# EAGLE design sensor_array (EAGLE 7.2.1)
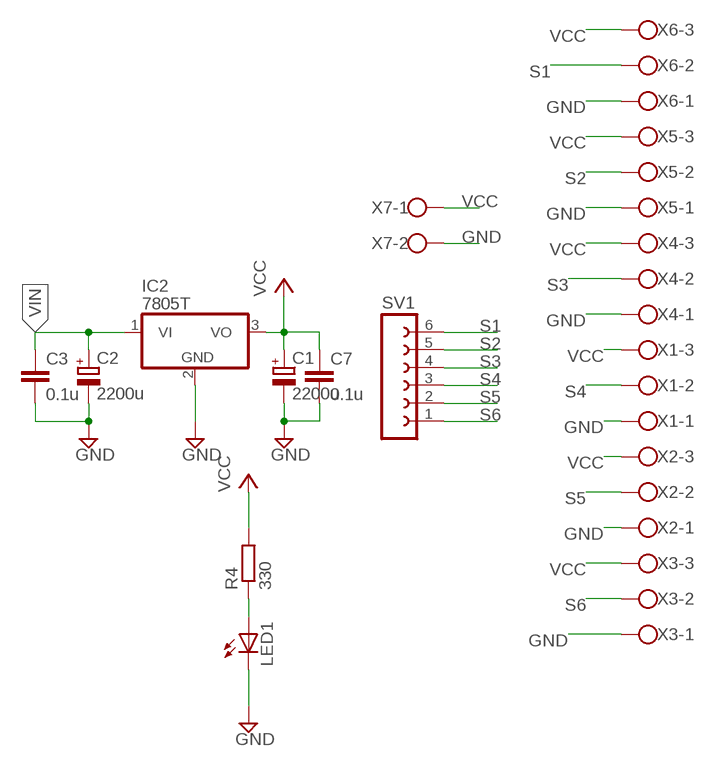
[diagram p0: schematic, sheet 1]

## Parts
C1  2200u  CPOL-EUE5-10.5  [E5-10,5]
C2  2200u  CPOL-EUE5-10.5  [E5-10,5]
C3  0.1u  C5/3  [C5B3]
C7  0.1u  C5/3  [C5B3]
IC2  7805T  [TO220H]
LED1  LED5MM  [LED5MM]
R4  330  R-EU_0207/10  [0207/10]
SV1  FE06-1  [FE06]
X1  W237-103  [W237-103]
X2  W237-103  [W237-103]
X3  W237-103  [W237-103]
X4  W237-103  [W237-103]
X5  W237-103  [W237-103]
X6  W237-103  [W237-103]
X7  W237-102  [W237-102]

## Nets
GND: C1.- C2.- C3.2 C7.2 IC2.2(GND) LED1.K(C) X1.1 X2.1 X3.1 X4.1 X5.1 X6.1 X7.2
N$13: LED1.A R4.1
S1: SV1.6 X6.2
S2: SV1.5 X5.2
S3: SV1.4 X4.2
S4: SV1.3 X1.2
S5: SV1.2 X2.2
S6: SV1.1 X3.2
VCC: C1.+ C7.1 IC2.3(VO) R4.2 X1.3 X2.3 X3.3 X4.3 X5.3 X6.3 X7.1
VIN: C2.+ C3.1 IC2.1(VI)

## Library data of the parts
C1 C2 = resistor:CPOL-EU: POLARIZED CAPACITOR, European symbol
C3 C7 = capacitor-wima:C: CAPACITOR naming: grid - package width
IC2 = linear:78*: Positive VOLTAGE REGULATOR Source: http://cache.national.com/ds/LM/LM78L05.pdf http://www.fairchildsemi.com/ds/LM/LM7805.pdf
LED1 = led:LED: LED OSRAM: - CHIPLED LG R971, LG N971, LY N971, LG Q971, LY Q971, LO R971, LY R971 LH N974, LH R974 LS Q976, LO Q976, LY Q976 LO Q996 - Hyper CHIPLED LW Q18S LB Q993, LB Q99A, LB R99A - SideLED LS A670, LO A670, LY A670, LG A670, LP A670 LB A673, LV A673, LT A673, LW A673 LH A674 LY A675 LS A676, LA A676, LO A676, LY A676, LW A676 LS A679, LY A679, LG A679 - Hyper Micro SIDELED® LS Y876, LA Y876, LO Y876, LY Y876 LT Y87S - SmartLED LW L88C, LW L88S LB L89C, LB L89S, LG L890 LS L89K, LO L89K, LY L89K LS L896, LA L896, LO L896, LY L896 - TOPLED LS T670, LO T670, LY T670, LG T670, LP T670 LSG T670, LSP T670, LSY T670, LOP T670, LYG T670 LG T671, LOG T671, LSG T671 LB T673, LV T673, LT T673, LW T673 LH T674 LS T676, LA T676, LO T676, LY T676, LB T676, LH T676, LSB T676, LW T676 LB T67C, LV T67C, LT T67C, LS T67K, LO T67K, LY T67K, LW E67C LS E67B, LA E67B, LO E67B, LY E67B, LB E67C, LV E67C, LT E67C LW T67C LS T679, LY T679, LG T679 LS T770, LO T770, LY T770, LG T770, LP T770 LB T773, LV T773, LT T773, LW T773 LH T774 LS E675, LA E675, LY E675, LS T675 LS T776, LA T776, LO T776, LY T776, LB T776 LHGB T686 LT T68C, LB T68C - Hyper Mini TOPLED® LB M676 - Mini TOPLED Santana® LG M470 LS M47K, LO M47K, LY M47K Source: http://www.osram.convergy.de LUXEON: - LUMILED® LXK2-PW12-R00, LXK2-PW12-S00, LXK2-PW14-U00, LXK2-PW14-V00 LXK2-PM12-R00, LXK2-PM12-S00, LXK2-PM14-U00 LXK2-PE12-Q00, LXK2-PE12-R00, LXK2-PE12-S00, LXK2-PE14-T00, LXK2-PE14-U00 LXK2-PB12-K00, LXK2-PB12-L00, LXK2-PB12-M00, LXK2-PB14-N00, LXK2-PB14-P00, LXK2-PB14-Q00 LXK2-PR12-L00, LXK2-PR12-M00, LXK2-PR14-Q00, LXK2-PR14-R00 LXK2-PD12-Q00, LXK2-PD12-R00, LXK2-PD12-S00 LXK2-PH12-R00, LXK2-PH12-S00 LXK2-PL12-P00, LXK2-PL12-Q00, LXK2-PL12-R00 Source: www.luxeon.com KINGBRIGHT: KA-3528ASYC Source: www.kingbright.com
R4 = resistor:R-EU_: RESISTOR, European symbol
SV1 = con-lsta:FE06-1: FEMALE HEADER; OC_FARNELL: unknown; OC_NEWARK: unknown
X1-X6 = con-wago-500:W237-103: WAGO SCREW CLAMP; MPN: 237-103; OC_FARNELL: unknown; OC_NEWARK: 18M7116
X7 = con-wago-500:W237-102: WAGO SCREW CLAMP; MPN: 237-102; OC_FARNELL: unknown; OC_NEWARK: 70K9898

## Board
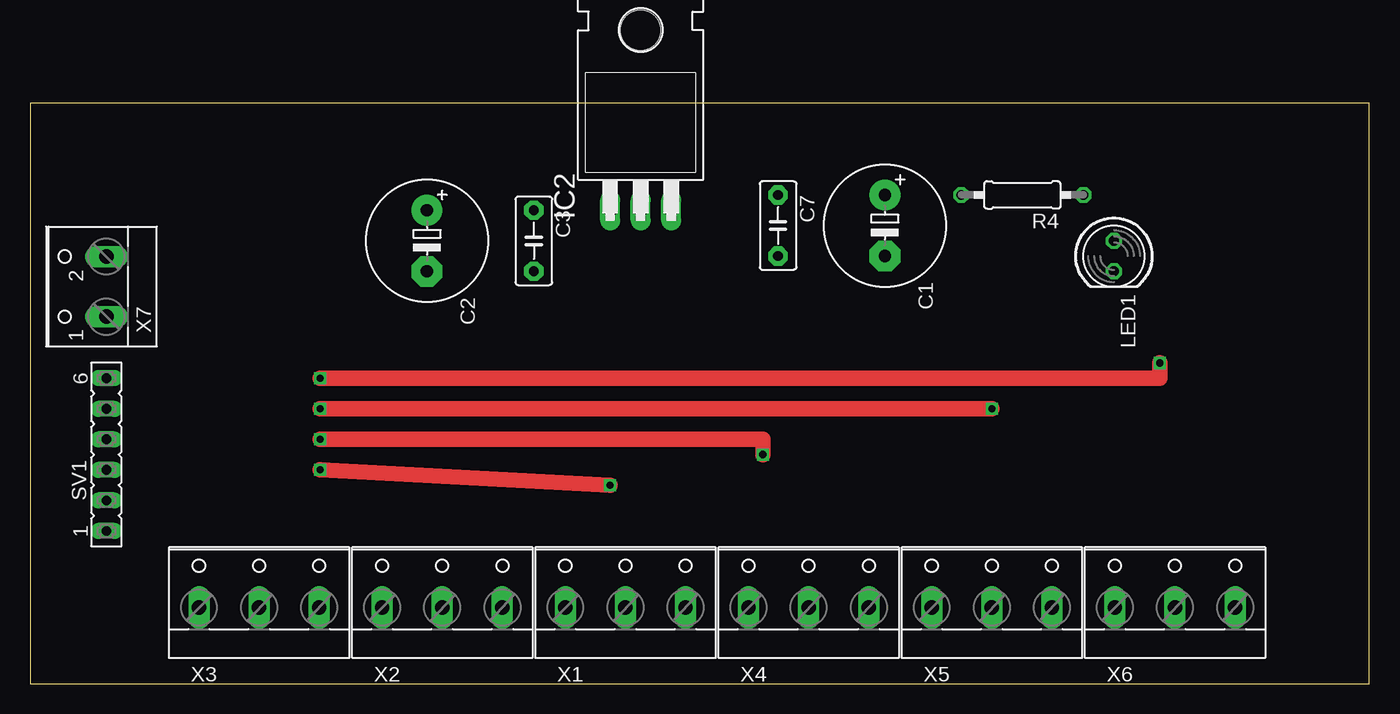
[diagram p1: board, top side]
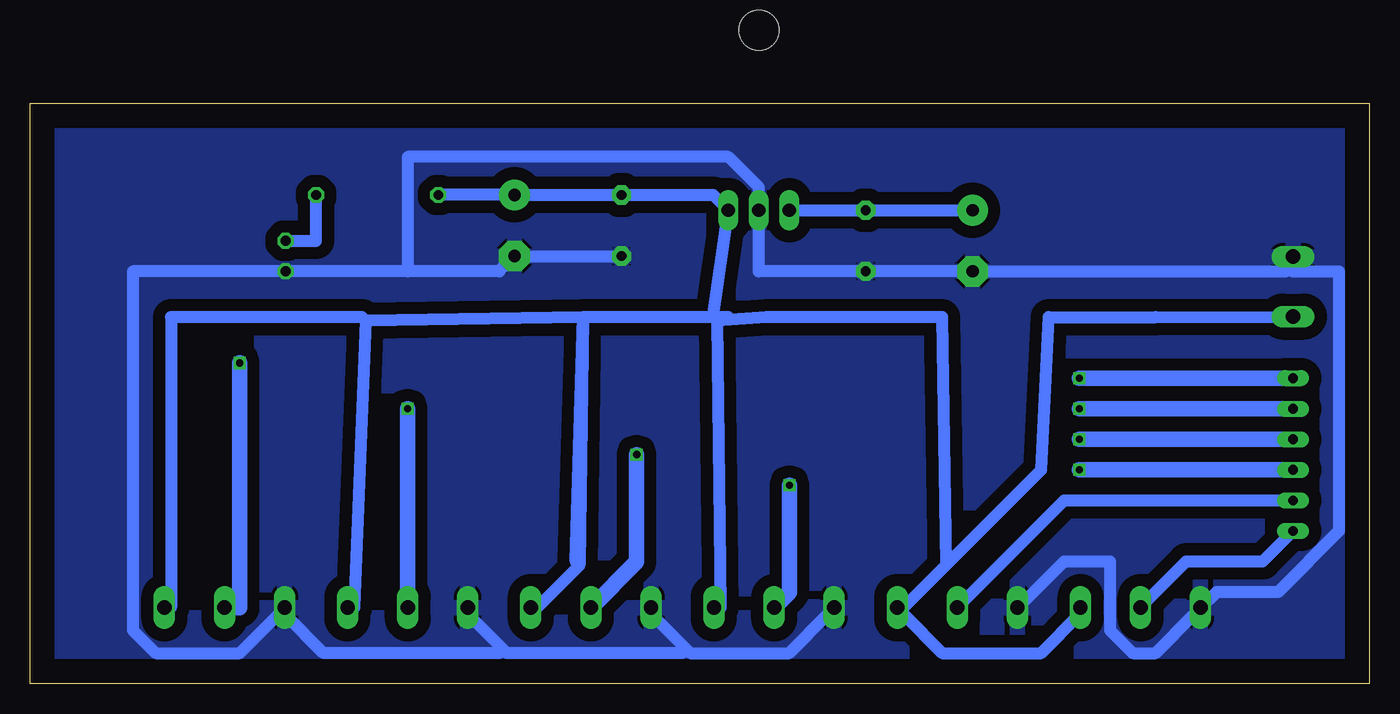
[diagram p2: board, bottom side, seen from below]

Size 111.43 x 48.25 mm. Coordinates in mm from the lower left corner, seen from the top.
Outline: 0,0 111.43,0 111.43,48.25 0,48.25 0,0
Copper layers (1*16): Top 0.035mm / dielectric 1.5mm / Bottom 0.035mm
Design rules "default *": minimum track width 40mil, minimum drill 24mil, track to track 40mil, track to pad 40mil, pad to pad 40mil, via to via 40mil, smd to smd 40mil, copper to edge 80mil, drill to drill 8mil, minimum pad ring 10mil, minimum via ring 8mil, stop-mask expansion 4mil, vias tented up to drill 0mil, thermal gap 10mil

### Footprints (pad centres in the part's own frame; a part is rotated, then mirrored left to right if it is on the bottom)
E5-10,5 = drill 1.016 pad 2.54: + -2.54,0 | drill 1.016 pad 2.54 octagon: - 2.54,0
C5B3 = drill 0.813 pad 1.6 octagon: 1 -2.54,0; 2 2.54,0
TO220H = drill 1.118 long: 1 -2.54,-10.16; 2 0,-10.16; 3 2.54,-10.16 | hole 3.302: 0,4.826
LED5MM = drill 0.813 octagon: A -1.27,0; K 1.27,0
0207/10 = drill 0.813 octagon: 1 -5.08,0; 2 5.08,0
FE06 = drill 0.813 long: 1 -6.35,0; 2 -3.81,0; 3 -1.27,0; 4 1.27,0; 5 3.81,0; 6 6.35,0
W237-103 = drill 1.194 long: 1 -5,-1.29; 2 0,-1.29; 3 5,-1.29
W237-102 = drill 1.194 long: 1 -2.5,-1.27; 2 2.5,-1.27

### Placement (x,y rotation side)
C1  71.12,38.1 270 top
C2  33.02,36.83 270 top
C3  41.91,36.83 270 top
C7  62.23,38.1 270 top
IC2  50.8,49.53 0 top
LED1  90.17,35.56 270 top
R4  82.55,40.64 180 top
SV1  6.35,19.05 90 top
X1  49.53,7.62 0 top
X2  34.29,7.62 0 top
X3  19.05,7.62 0 top
X4  64.77,7.62 0 top
X5  80.01,7.62 0 top
X6  95.25,7.62 0 top
X7  5.08,33.02 90 top

### Tracks (layer width: path | path; a pad name or v marks a point on that pad's centre or on a via)
GND
  Bottom 1.016: 56.83,2.86 59.69,5.72 X4.1 | 56.83,2.86 56.52,2.54 48.26,2.54 45.09,5.72 X1.1 | 72.07,2.86 71.75,2.54 57.15,2.54 56.83,2.86 | 72.07,2.86 74.93,5.72 X5.1 | 72.07,2.86 72.39,2.54 87,2.54 90.17,5.72 X6.1 90.81,5.72 93.98,2.54 100.97,2.54 102.87,4.45 102.87,34.29 LED1.K 80.01,34.29 | 80.01,34.29 72.39,34.29 C1.- C7.2 | X2.1 29.21,6.35 25.4,10.16 21.59,10.16 21.59,4.45 19.68,2.54 17.78,2.54 14.61,5.72 X3.1 13.97,6.35 12.7,7.62 7.62,7.62 2.54,12.7 2.54,34.29 6.35,34.29 6.67,34.61 | 6.67,34.61 6.99,34.29 C2.- C3.2 50.8,34.29 IC2.2 50.8,41.28 53.34,43.81 80.01,43.81 80.01,34.29 | 6.67,34.61 6.35,34.92 X7.2
  pour Bottom: 0,48.26 111.76,48.26 111.76,0 0,0
N$13
  Bottom 1.016: R4.1 87.63,36.83 LED1.A
S1  (via drill 0.6)
  Top 1.27: v24.13,25.4 93.98,25.4 v93.98,26.67
  Bottom 1.27: X6.2 93.98,6.33 v93.98,26.67 | SV1.6 v24.13,25.4
S2  (via drill 0.6)
  Top 1.27: v24.13,22.86 v80.01,22.86
  Bottom 1.27: X5.2 v80.01,22.86 | SV1.5 v24.13,22.86
S3  (via drill 0.6)
  Top 1.27: v24.13,20.32 60.96,20.32 v60.96,19.05
  Bottom 1.27: X4.2 60.96,10.14 v60.96,19.05 | SV1.4 v24.13,20.32
S4  (via drill 0.6)
  Top 1.27: v24.13,17.78 v48.26,16.51
  Bottom 1.27: X1.2 48.26,7.6 v48.26,16.51 | SV1.3 v24.13,17.78
S5
  Bottom 1.016: SV1.2 25.4,15.24 34.29,6.35 X2.2
S6
  Bottom 1.016: SV1.1 8.89,10.16 15.24,10.16 19.05,6.35 X3.2
VCC
  Bottom 1.016: R4.2 C1.+ C7.1 54.61,40.64 IC2.3 54.61,30.48 | 35.24,9.84 38.73,6.35 X2.3 38.73,5.72 35.56,2.54 27.3,2.54 24.13,5.72 X3.3 | 35.24,9.84 27.3,17.78 26.67,30.48 17.78,30.48 X7.1 | 54.29,30.16 50.16,30.48 35.56,30.48 35.24,9.84 | 54.29,30.16 53.98,6.35 X1.3 | 65.41,30.48 65.72,9.84 | 65.72,9.84 69.22,6.35 X4.3 | 54.61,30.48 53.34,30.48 54.29,30.16 | 54.61,30.48 65.41,30.48 | 65.41,30.48 83.5,30.16 | 83.5,30.16 84.45,6.35 X5.3 | 65.41,30.48 66.04,10.16 65.72,9.84 | X6.3 99.69,6.35 99.69,30.48 83.82,30.48 83.5,30.16
VIN
  Bottom 1.016: IC2.1 C3.1 C2.+